# Altium schematic sheet STLINKV2-1.SchDoc
size A
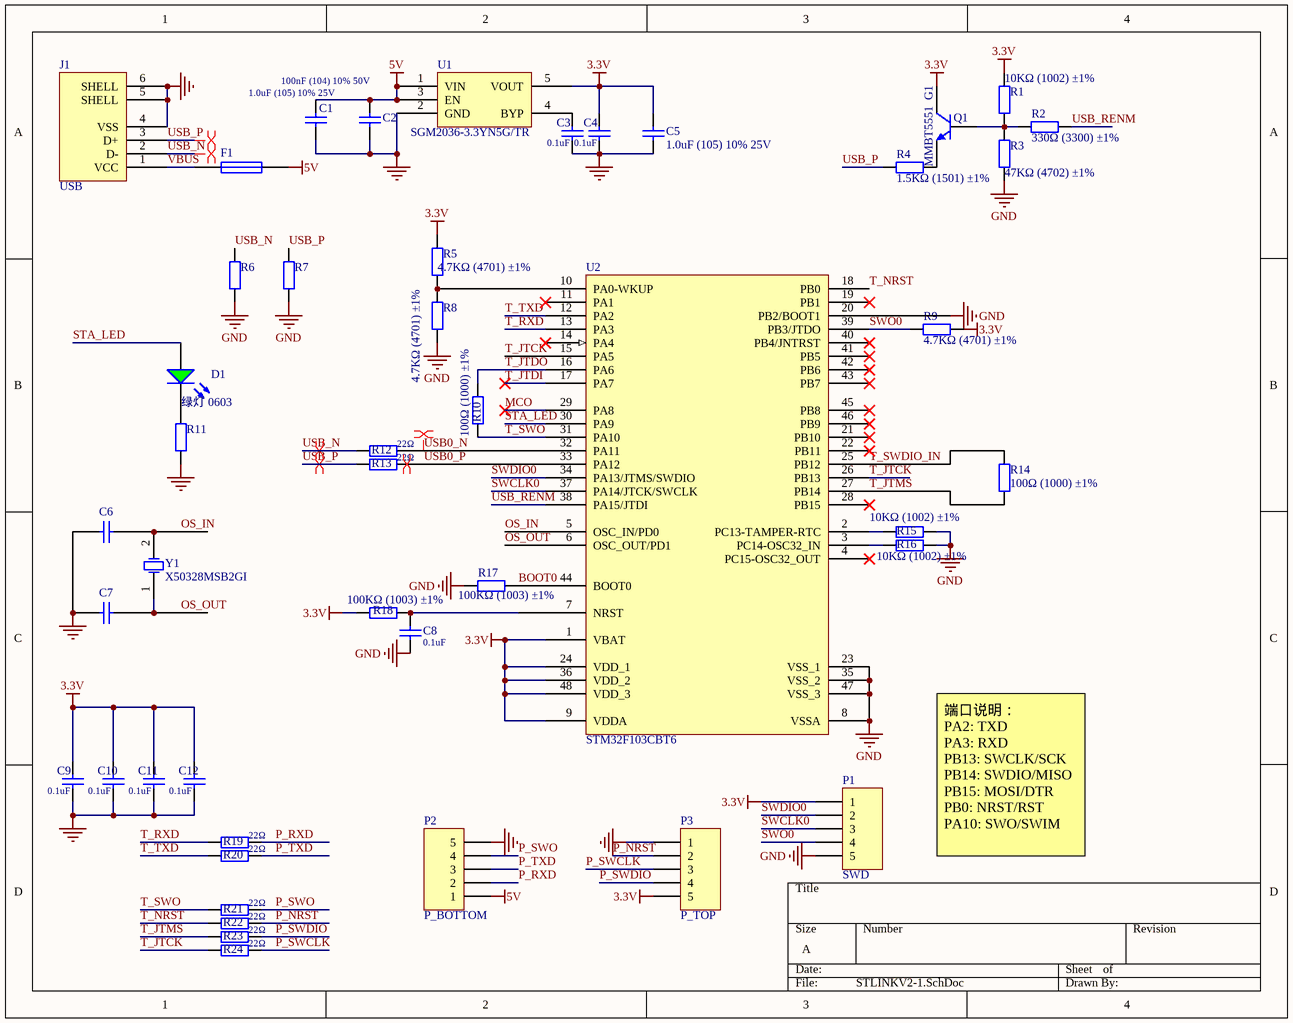
[diagram p0: STLINKV2-1.SchDoc]

## Parts
C1  1.0uF (105) 10% 25V  [0402_C]
C2  100nF (104) 10% 50V  [0603_C]
C3  VAL: 0.1uF  [0402_C]  (hidden comment: 100nF (104) 10% 16V)
C4  VAL: 0.1uF  [0402_C]  (hidden comment: 100nF (104) 10% 16V)
C5  1.0uF (105) 10% 25V  [0402_C]
C6  20pF (200) 5% 50V  [0402_C]  (value not drawn)
C7  20pF (200) 5% 50V  [0402_C]  (value not drawn)
C8  VAL: 0.1uF  [0402_C]  (hidden comment: 100nF (104) 10% 16V)
C9  VAL: 0.1uF  [0402_C]  (hidden comment: 100nF (104) 10% 16V)
C10  VAL: 0.1uF  [0402_C]  (hidden comment: 100nF (104) 10% 16V)
C11  VAL: 0.1uF  [0402_C]  (hidden comment: 100nF (104) 10% 16V)
C12  VAL: 0.1uF  [0402_C]  (hidden comment: 100nF (104) 10% 16V)
D1  绿灯 0603  [0603_LED_S1]
F1  Fuse1  [0805-1]  (value not drawn)
J1  USB  [USB-B]
P1  SWD  [SIP5-1.27]
P2  P_BOTTOM  [HEADER 5]
P3  P_TOP  [HEADER 5]
Q1  MMBT5551  G1  [SOT-23(SOT-23-3)]
R1  10KΩ (1002) ±1%  [0402_R]
R2  330Ω (3300) ±1%  [0402_R]
R3  47KΩ (4702) ±1%  [0402_R]
R4  1.5KΩ (1501) ±1%  [0402_R]
R5  4.7KΩ (4701) ±1%  [0402_R]
R6  1MΩ (1004) ±1%  [0402_R]  (value not drawn)  (no BOM)
R7  1MΩ (1004) ±1%  [0402_R]  (value not drawn)  (no BOM)
R8  4.7KΩ (4701) ±1%  [0402_R]
R9  4.7KΩ (4701) ±1%  [0402_R]
R10  100Ω (1000) ±1%  [0402_R]
R11  2.2KΩ (2201) ±1%  [0402_R]  (value not drawn)
R12  VAL: 22Ω  [0402_R]  (hidden comment: 22Ω (22R0) ±1%)
R13  VAL: 22Ω  [0402_R]  (hidden comment: 22Ω (22R0) ±1%)
R14  100Ω (1000) ±1%  [0402_R]
R15  10KΩ (1002) ±1%  [0402_R]
R16  10KΩ (1002) ±1%  [0402_R]
R17  100KΩ (1003) ±1%  [0402_R]
R18  100KΩ (1003) ±1%  [0402_R]
R19  VAL: 22Ω  [0402_R]  (hidden comment: 22Ω (22R0) ±1%)
R20  VAL: 22Ω  [0402_R]  (hidden comment: 22Ω (22R0) ±1%)
R21  VAL: 22Ω  [0402_R]  (hidden comment: 22Ω (22R0) ±1%)
R22  VAL: 22Ω  [0402_R]  (hidden comment: 22Ω (22R0) ±1%)
R23  VAL: 22Ω  [0402_R]  (hidden comment: 22Ω (22R0) ±1%)
R24  VAL: 22Ω  [0402_R]  (hidden comment: 22Ω (22R0) ±1%)
U1  SGM2036-3.3YN5G/TR  [SOT23-5]
U2  STM32F103CBT6  [LQFP-48_7x7x05P]
Y1  X50328MSB2GI  [SMD-5032_2P]

## Nets
3.3V: C4.2 C5.2 C9.2 C10.2 C11.2 C12.2 P1.1 P3.5 Q1.3(C) R1.2 R5.2 R9.2 R18.1 U1.5(VOUT) U2.1(VBAT) U2.9(VDDA) U2.24(VDD_1) U2.36(VDD_2) U2.48(VDD_3)
5V: C1.2 C2.2 F1.1 P2.1 U1.1(VIN) U1.3(EN)
GND: C1.1 C2.1 C3.1 C4.1 C5.1 C6.1 C7.1 C8.2 C9.1 C10.1 C11.1 C12.1 J1.4(VSS) J1.5(SHELL) J1.6(SHELL) P1.5 P2.5 P3.1 R3.1 R6.1 R7.1 R8.1 R11.1 R15.2 R16.2 R17.1 U1.2(GND) U2.8(VSSA) U2.20(PB2/BOOT1) U2.23(VSS_1) U2.35(VSS_2) U2.47(VSS_3)
BOOT0: R17.2 U2.44(BOOT0)
MCO: U2.29(PA8)
OS_IN: C6.2 U2.5(OSC_IN/PD0) Y1.2(OSC2)
OS_OUT: C7.2 U2.6(OSC_OUT/PD1) Y1.1(OSC1)
P_NRST: P3.2 R22.2
P_RXD: P2.2 R19.2
P_SWCLK: P3.3 R24.2
P_SWDIO: P3.4 R23.2
P_SWO: P2.4 R21.2
P_TXD: P2.3 R20.2
STA_LED: D1.A U2.30(PA9)
SWCLK0: P1.3 U2.37(PA14/JTCK/SWCLK)
SWDIO0: P1.2 U2.34(PA13/JTMS/SWDIO)
SWO0: P1.4 R9.1 U2.39(PB3/JTDO)
T_JTCK: R24.1 U2.15(PA5) U2.26(PB13)
T_JTDI: U2.17(PA7)
T_JTDO: R10.1 U2.16(PA6)
T_JTMS: R14.1 R23.1 U2.27(PB14)
T_NRST: R22.1 U2.18(PB0)
T_RXD: R19.1 U2.13(PA3)
T_SWDIO_IN: R14.2 U2.25(PB12)
T_SWO: R10.2 R21.1 U2.31(PA10)
T_TXD: R20.1 U2.12(PA2)
USB0_N: R12.2 U2.32(PA11)
USB0_P: R13.2 U2.33(PA12)
USB_N: J1.2(D-) R6.2 R12.1
USB_P: J1.3(D+) R4.1 R7.2 R13.1
USB_RENM: R2.2 U2.38(PA15/JTDI)
VBUS: F1.2 J1.1(VCC)
NetC3_2: C3.2 U1.4(BYP)
NetC8_1: C8.1 R18.2 U2.7(NRST)
NetD1_K: D1.K R11.2
NetQ1_1: Q1.1(B) R1.1 R2.1 R3.2
NetQ1_2: Q1.2(E) R4.2
NetR5_1: R5.1 R8.2 U2.10(PA0-WKUP)
NetR15_1: R15.1 U2.2(PC13-TAMPER-RTC)
NetR16_1: R16.1 U2.3(PC14-OSC32_IN)

Not connected (* = marked no-connect by the designer): U2 4(PC15-OSC32_OUT)* 11(PA1)* 14(PA4)* 19(PB1)* 21(PB10)* 22(PB11)* 28(PB15)* 40(PB4/JNTRST)* 41(PB5)* 42(PB6)* 43(PB7)* 45(PB8)* 46(PB9)*

## Layout directives
differential pair: USB0_N, USB0_P, USB_N, USB_P

## Notes on the sheet
- 端口说明：
  PA2: TXD
  PA3: RXD
  PB13: SWCLK/SCK
  PB14: SWDIO/MISO
  PB15: MOSI/DTR
  PB0: NRST/RST
  PA10: SWO/SWIM

## Library data of the parts
C1 C5 = 0402 1.0uF (105) 10% 25V: 贴片电容; ComponentLink1Description: 供应商链接; ComponentLink1URL: http://www.szlcsc.com/product/details_53938.html; Package: 0402; Supplier: LC; SuppliersPartNumber: C52923
C2 = 0603 100nF (104) 10% 50V: 贴片电容; ComponentLink1Description: 供应商链接; ComponentLink1URL: http://www.szlcsc.com/product/details_15331.html; Package: 0603; Supplier: LC; SuppliersPartNumber: C14663
C3 C4 C8-C12 = 0402 100nF (104) 10% 16V: 贴片电容; ComponentLink1Description: 供应商链接; ComponentLink1URL: http://www.szlcsc.com/product/details_1877.html; Package: 0402; Supplier: LC; SuppliersPartNumber: C1525
C6 C7 = 0402 20pF (200) 5% 50V: 贴片电容; ComponentLink1Description: 供应商链接; ComponentLink1URL: http://www.szlcsc.com/product/details_1906.html; Package: 0402; Supplier: LC; SuppliersPartNumber: C1554; VAL: 20pF
D1 = 0603 绿灯: 发光二极管; ComponentLink1Description: 供应商链接; ComponentLink1URL: http://www.szlcsc.com/product/details_73152.html; Package: 0603; Supplier: LC; SuppliersPartNumber: C72043
F1 = Fuse1: 保险丝; VAL: 500mA
J1 = USB: USB接口
P1-P3 = Header 5: Header, 5-Pin
Q1 = SOT-23 MMBT5551  G1: 三极管; ComponentLink1Description: 供应商链接; ComponentLink1URL: http://www.szlcsc.com/product/details_2502.html; Package: SOT-23; Supplier: LC; SuppliersPartNumber: C2145
R1 R15 R16 = 0402 10KΩ (1002) 1%: 贴片电阻; ComponentLink1Description: 供应商链接; ComponentLink1URL: http://www.szlcsc.com/product/details_26487.html; Package: 0402; Supplier: LC; SuppliersPartNumber: C25744
R2 = 0402 330Ω (3300) 1%: 贴片电阻; ComponentLink1Description: 供应商链接; ComponentLink1URL: http://www.szlcsc.com/product/details_25847.html; Package: 0402; Supplier: LC; SuppliersPartNumber: C25104
R3 = 0402 47KΩ (4702) 1%: 贴片电阻; ComponentLink1Description: 供应商链接; ComponentLink1URL: http://www.szlcsc.com/product/details_26535.html; Package: 0402; Supplier: LC; SuppliersPartNumber: C25792
R4 = 0402 1.5KΩ (1501) 1%: 贴片电阻; ComponentLink1Description: 供应商链接; ComponentLink1URL: http://www.szlcsc.com/product/details_26610.html; Package: 0402; Supplier: LC; SuppliersPartNumber: C25867
R5 R8 R9 = 0402 4.7KΩ (4701) 1%: 贴片电阻; ComponentLink1Description: 供应商链接; ComponentLink1URL: http://www.szlcsc.com/product/details_26643.html; Package: 0402; Supplier: LC; SuppliersPartNumber: C25900
R6 R7 = 0402 1MΩ (1004) 1%: TVS; ComponentLink1Description: 供应商链接; ComponentLink1URL: http://www.szlcsc.com/product/details_26826.html; Package: 0402; Supplier: LC; SuppliersPartNumber: C26083
R10 R14 = 0402 100Ω (1000) 1%: 贴片电阻; ComponentLink1Description: 供应商链接; ComponentLink1URL: http://www.szlcsc.com/product/details_25819.html; Package: 0402; Supplier: LC; SuppliersPartNumber: C25076
R11 = 0402 2.2KΩ (2201) 1%: 贴片电阻; ComponentLink1Description: 供应商链接; ComponentLink1URL: http://www.szlcsc.com/product/details_26622.html; Package: 0402; Supplier: LC; SuppliersPartNumber: C25879; VAL: 2.2KΩ
R12 R13 R19-R24 = 0402 22Ω (22R0) 1%: 贴片电阻; ComponentLink1Description: 供应商链接; ComponentLink1URL: http://www.szlcsc.com/product/details_25835.html; Package: 0402; Supplier: LC; SuppliersPartNumber: C25092
R17 R18 = 0402 100KΩ (1003) 1%: 贴片电阻; ComponentLink1Description: 供应商链接; ComponentLink1URL: http://www.szlcsc.com/product/details_26484.html; Package: 0402; Supplier: LC; SuppliersPartNumber: C25741
U1 = SPX3819: 低压差线性稳压(LDO); ComponentLink1Description: 供应商链接; ComponentLink1URL: http://item.szlcsc.com/93595.html; Package: SOT-23-5; SuppliersPartNumber: C92402; Supplier: LC
U2 = STM32F103C8T6: STM32 ARM-based 32-bit MCU with 64 Kbytes Flash, 48-pin LQFP, Industrial Temperature; ComponentLink1Description: 供应商链接; ComponentLink1URL: http://www.szlcsc.com/product/details_9243.html; Package: LQFP-48_7x7x05P; Supplier: LC; SuppliersPartNumber: C8734
Y1 = SMD-5032_2P 8MHz 20ppm 20pF: 贴片无源晶振8MHz ±20ppm 20pF; ComponentLink1Description: 供应商链接; ComponentLink1URL: http://www.szlcsc.com/product/details_117214.html; Package: SMD-5032_2P; Supplier: LC; SuppliersPartNumber: C115962